# EAGLE schematic power supply (EAGLE 6.5.0)
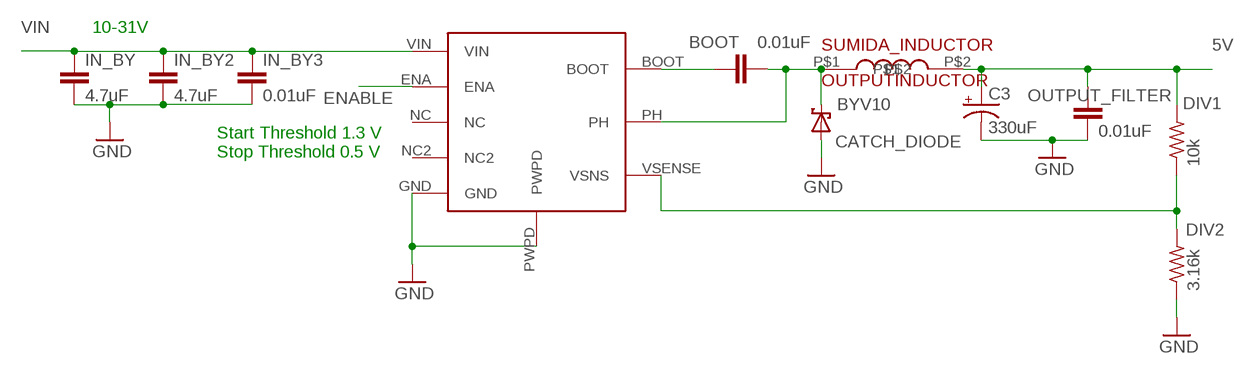
[diagram p0: schematic, sheet 1]

## Parts
BOOT  0.01uF  C-EUC0805  [C0805]
C3  330uF  CPOL-USF  [PANASONIC_F]
CATCH_DIODE  BYV10  [DO41-10]
DIV1  10k  R-US_R0805  [R0805]
DIV2  3.16k  R-US_R0805  [R0805]
IN_BY  4.7uF  C-EUC0805  [C0805]
IN_BY2  4.7uF  C-EUC0805  [C0805]
IN_BY3  0.01uF  C-EUC0805  [C0805]
OUTPUT_FILTER  0.01uF  C-EUC0805  [C0805]
OUTPUTINDUCTOR  SUMIDA_INDUCTOR  [SUMIDA_INDUCTOR]
U$1  TPS5450  [TPS5450-Q1]

## Nets
5V: C3.+ DIV1.2 OUTPUT_FILTER.1 OUTPUTINDUCTOR.P$2
ENABLE: U$1.ENA
GND: C3.- CATCH_DIODE.A DIV2.1 IN_BY2.2 IN_BY3.2 IN_BY.2 OUTPUT_FILTER.2 U$1.GND U$1.PWPD
N$1: BOOT.1 U$1.BOOT
N$2: BOOT.2 CATCH_DIODE.C OUTPUTINDUCTOR.P$1 U$1.PH
N$3: DIV1.1 DIV2.2 U$1.VSENSE(VSNS)
VIN: IN_BY2.1 IN_BY3.1 IN_BY.1 U$1.VIN
Unconnected: U$1.NC U$1.NC2

## Notes on the sheet
- 10-31V
- Start Threshold 1.3 V
  Stop Threshold 0.5 V

## Library data of the parts
BOOT IN_BY IN_BY2 IN_BY3 OUTPUT_FILTER = rcl:C-EU: CAPACITOR, European symbol
C3 = rcl:CPOL-US: POLARIZED CAPACITOR, American symbol; DIGIKEY: PCE3779CT-ND
CATCH_DIODE = diode:BYV10: DIODE power diode; DIGIKEY: SJPZ-N40VLCT-ND
DIV1 DIV2 = rcl:R-US_: RESISTOR, American symbol
OUTPUTINDUCTOR = ian:SUMIDA_INDUCTOR; DIGIKEY: 308-1333-1-ND
U$1 = ian:TPS5450